# EAGLE design Game of Life v1 (EAGLE 9.6.2)
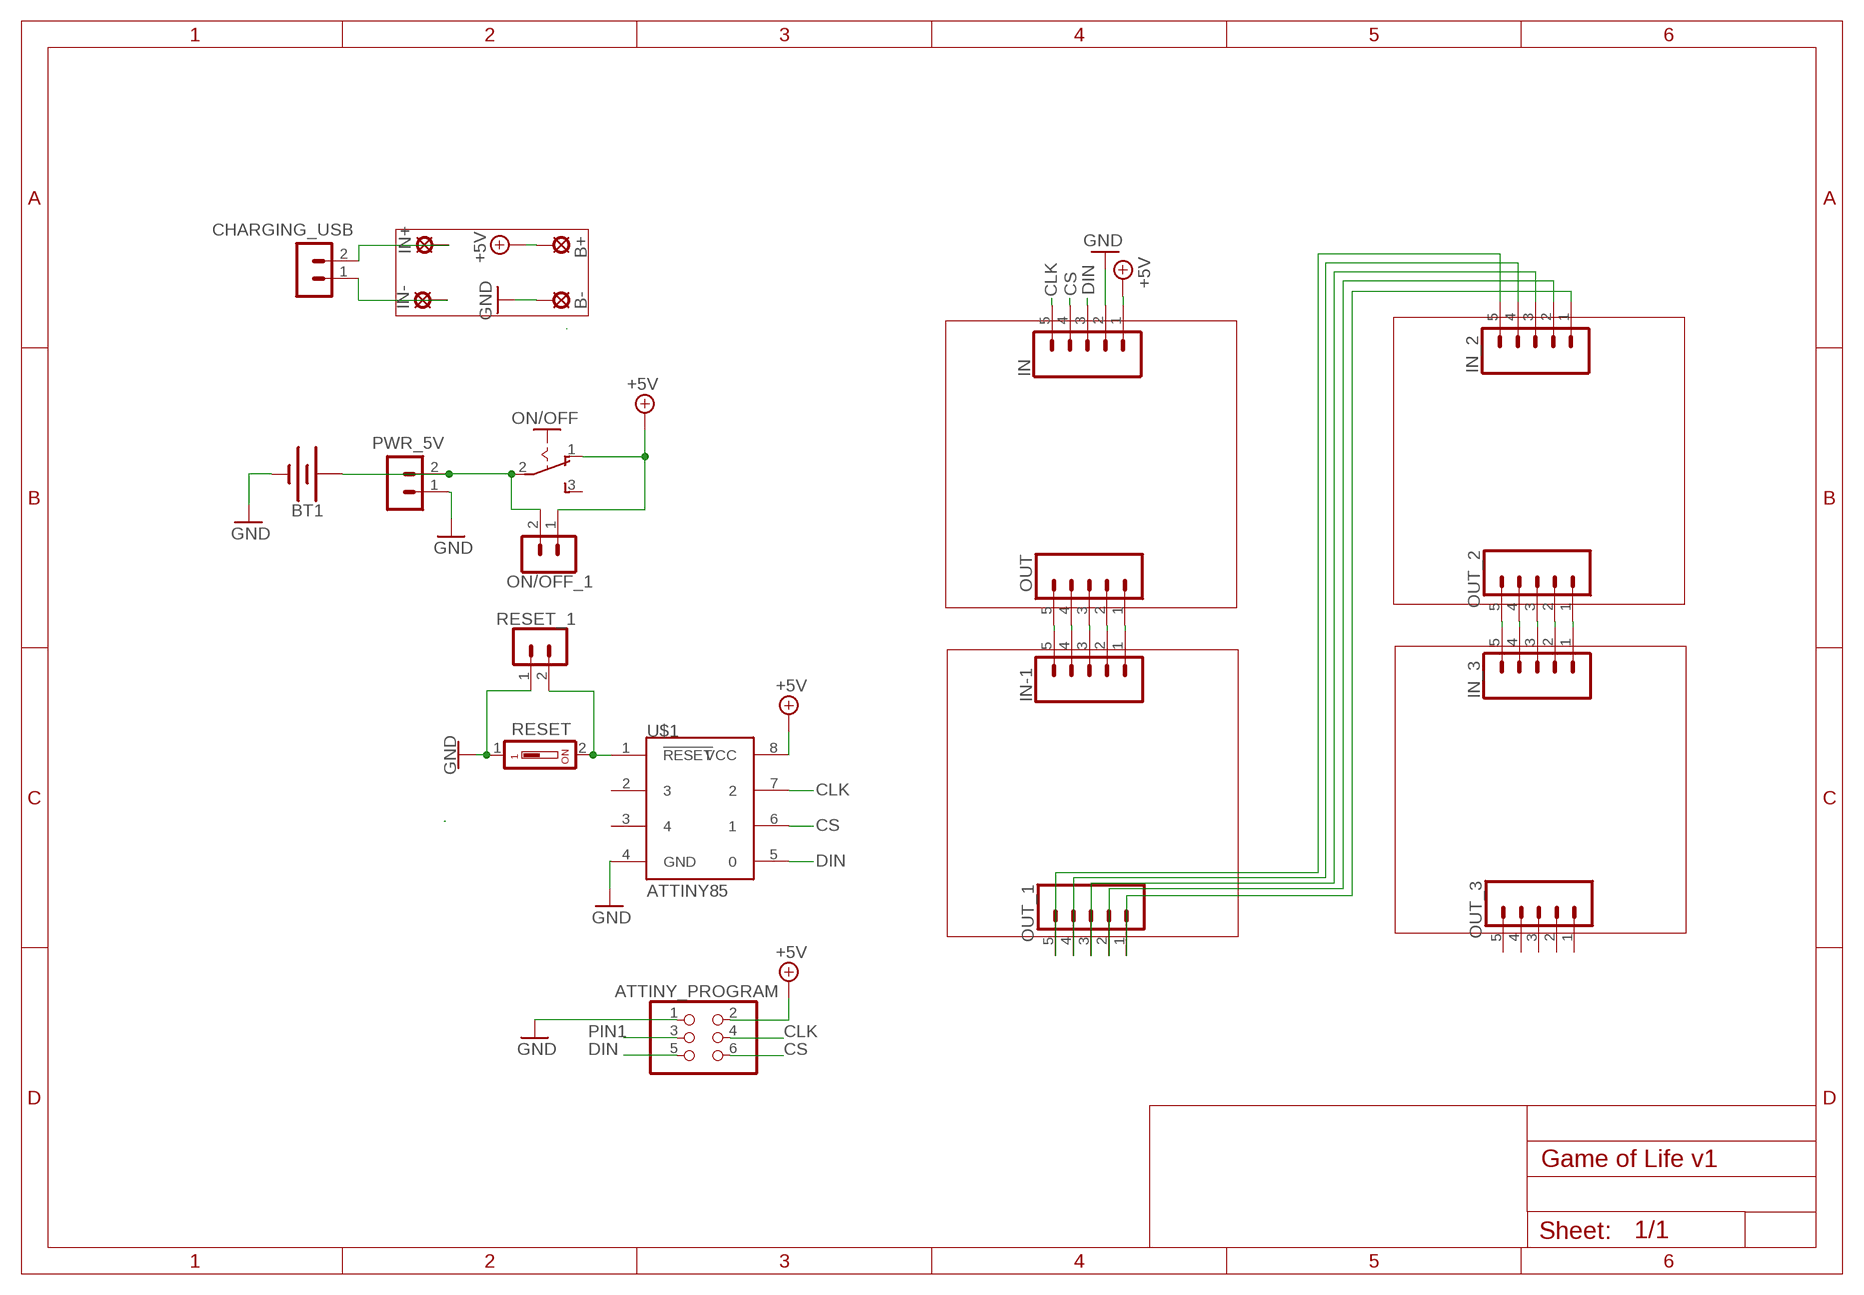
[diagram p0: schematic, sheet 1]

## Parts
ATTINY_PROGRAM  PINHD-2X3  [2X03]
B+  LSP11  [LSP11]
B-  LSP11  [LSP11]
BT1  BATTERY-18650  [BATTERY_18650-HOLDER]
CHARGING_USB  B2B-PH-K-S  [B2B-PH-K-S]
IN  CONN_05  [1X05]
IN+  LSP11  [LSP11]
IN-  LSP11  [LSP11]
IN-1  CONN_05  [1X05]
IN_2  CONN_05  [1X05]
IN_3  CONN_05  [1X05]
ON/OFF  M251  [M251]
ON/OFF_1  B2B-PH-K-S  [B2B-PH-K-S]
OUT  CONN_05  [1X05]
OUT_1  CONN_05  [1X05]
OUT_2  CONN_05  [1X05]
OUT_3  CONN_05  [1X05]
PWR_5V  B2B-PH-K-S  [B2B-PH-K-S]
RESET  DS01  [DS-01]
RESET_1  B2B-PH-K-S  [B2B-PH-K-S]
U$1  ATTINY85  [8P3]

## Nets
+5V: ATTINY_PROGRAM.2 B+.MP IN.1 ON/OFF.1(O) ON/OFF_1.1 U$1.8(VCC)
CLK: ATTINY_PROGRAM.4 IN.5 U$1.7
CS: ATTINY_PROGRAM.6 IN.4 U$1.6
DIN: ATTINY_PROGRAM.5 IN.3 U$1.5
GND: ATTINY_PROGRAM.1 B-.MP BT1.GND@1(-) IN.2 PWR_5V.1 RESET.1 RESET_1.1 U$1.4(GND)
N$2: BT1.PWR@1(+) ON/OFF.2(P) ON/OFF_1.2 PWR_5V.2
N$3: CHARGING_USB.2 IN+.MP
N$4: IN-1.1 OUT.1
N$5: IN-1.2 OUT.2
N$6: IN-1.3 OUT.3
N$7: IN-1.4 OUT.4
N$8: IN-1.5 OUT.5
N$9: IN_3.1 OUT_2.1
N$10: IN_3.2 OUT_2.2
N$11: IN_3.3 OUT_2.3
N$12: IN_3.4 OUT_2.4
N$13: IN_3.5 OUT_2.5
N$14: IN_2.1 OUT_1.1
N$15: IN_2.2 OUT_1.2
N$16: IN_2.3 OUT_1.3
N$18: IN_2.5 OUT_1.5
N$19: IN_2.4 OUT_1.4
N$20: CHARGING_USB.1 IN-.MP
PIN1: ATTINY_PROGRAM.3 RESET.2 RESET_1.2 U$1.1(!RESET)
Unconnected: ON/OFF.3(S) OUT_3.1 OUT_3.2 OUT_3.3 OUT_3.4 OUT_3.5 U$1.2 U$1.3

## Library data of the parts
ATTINY_PROGRAM = pinhead:PINHD-2X3: PIN HEADER
B+ B- IN+ IN- = solpad:LSP11: SOLDER PAD drill 1.1 mm
BT1 = SparkFun-Batteries:BATTERY: Battery - Single Cell A variety of battery chemistries, sizes, and footprints. Device List: 20MM_PTH - Coin Cell Battery Holder - 20mm (PTH) <https://www.sparkfun.com/products/783> 20MM_PTH_KIT- Coin Cell battery Holder - 20 mm (PTH) <http://www.sparkfun.com/products/783>kit version with special mask 6.8MM_PTH - Coin Cell Battery Holder - 6.8MM(SMD) <https://www.digikey.com/product-detail/en/seiko-instruments/MS621FE-FL11E/728-1057-ND/1889208?WT.srch=1&gclid=CNOQ5a6LzdQCFZS2wAodXCkE0g> 12MM_SMD - Coin Cell Battery Holder - 12mm (SMD) <https://www.sparkfun.com/products/10592> 12MM_PTH - Coin Cell Battery Holder - 12mm (PTH) <https://www.sparkfun.com/products/7948> 20MM_SMD - 20mm Coin Cell Battery Holder (SMD) (2 legs) Used on the Big Time Watch Kit <https://www.sparkfun.com/products/11734> 20MM_SMD_4LEGS - Coin Cell Battery Holder - 20mm (SMD) <https://www.sparkfun.com/products/11892> 20MM_SMD_4LEGS_OVERPASTE - Coin Cell Battery Holder - 20mm (SMD) <https://www.sparkfun.com/products/11892> (Over-paste on the legs) 24.5MM_PTH - Coin Cell Battery Holder - 24.5mm (PTH) <https://www.sparkfun.com/products/8863> 9V - 9V Battery Holder - PC Mount Used on the SparkFun SparkPunk Sound Kit <https://www.sparkfun.com/products/11177> and SparkFun SparkPunk Sequencer Kit <https://www.sparkfun.com/products/12707> 18650 - Battery Holder - 18650 (PTH) <https://www.sparkfun.com/products/13113> AA - Battery Holder - 1xAA (PTH) <https://www.sparkfun.com/products/7949> AAA - Battery Holder - 1xAAA (PTH) <https://www.sparkfun.com/products/12718> AA_KIT - Battery Holder - 1xAA (PTH) <https://www.sparkfun.com/products/7949> Special kit package - pads only have exposed copper on one side of the board. AAA_KIT - Battery Holder - 1xAAA (PTH) <https://www.sparkfun.com/products/12718> Special kit package - pads only have exposed copper on one side of the board.; PROD_ID: BATT-12327; SF_SKU: PRT-13113
CHARGING_USB ON/OFF_1 PWR_5V RESET_1 = con-JST PH:B2B-PH: JST PH series header 2.00mm pitch disconnectable crimp style connectors, vertical (side entry type), 2 pins
IN IN-1 IN_2 IN_3 OUT OUT_1-OUT_3 = SparkFun-Connectors:CONN_05: Multi connection point. Often used as Generic Header-pin footprint for 0.1 inch spaced/style header connections On any of the 0.1 inch spaced packages, you can populate with these: Break Away Headers - Straight <https://www.sparkfun.com/products/116> (PRT-00116) Break Away Male Headers - Right Angle <https://www.sparkfun.com/products/553> (PRT-00553) Female Headers <https://www.sparkfun.com/products/115> (PRT-00115) Break Away Headers - Machine Pin <https://www.sparkfun.com/products/117> (PRT-00117) Break Away Female Headers - Swiss Machine Pin <https://www.sparkfun.com/products/743> (PRT-00743) For SCREWTERMINALS and SPRING TERMINALS visit here: Screw Terimnals on SparkFun.com <https://www.sparkfun.com/search/results?term=Screw+Terminals> (5mm/3.5mm/2.54mm spacing) This device is also useful as a general connection point to wire up your design to another part of your project. Our various solder wires solder well into these plated through hole pads. Hook-Up Wire - Assortment (Stranded, 22 AWG) <https://www.sparkfun.com/products/11375> (PRT-11375) Hook-Up Wire - Assortment (Solid Core, 22 AWG) <https://www.sparkfun.com/products/11367> (PRT-11367) View the entire wire category on our website here <https://www.sparkfun.com/categories/141> Special notes: Molex polarized connector foot print use with SKU : PRT-08231 with associated crimp pins and housings. 1MM SMD Version SKU: PRT-10208
ON/OFF = switches M Dunn:M251: SLIDING SWITCH Mors, distributor Buerklin, 11G702
RESET = 5mm SPST Switch:DS01: DIL/CODE SWITCH; OC_FARNELL: unknown; OC_NEWARK: unknown
U$1 = attiny85:ATTINY85

## Board
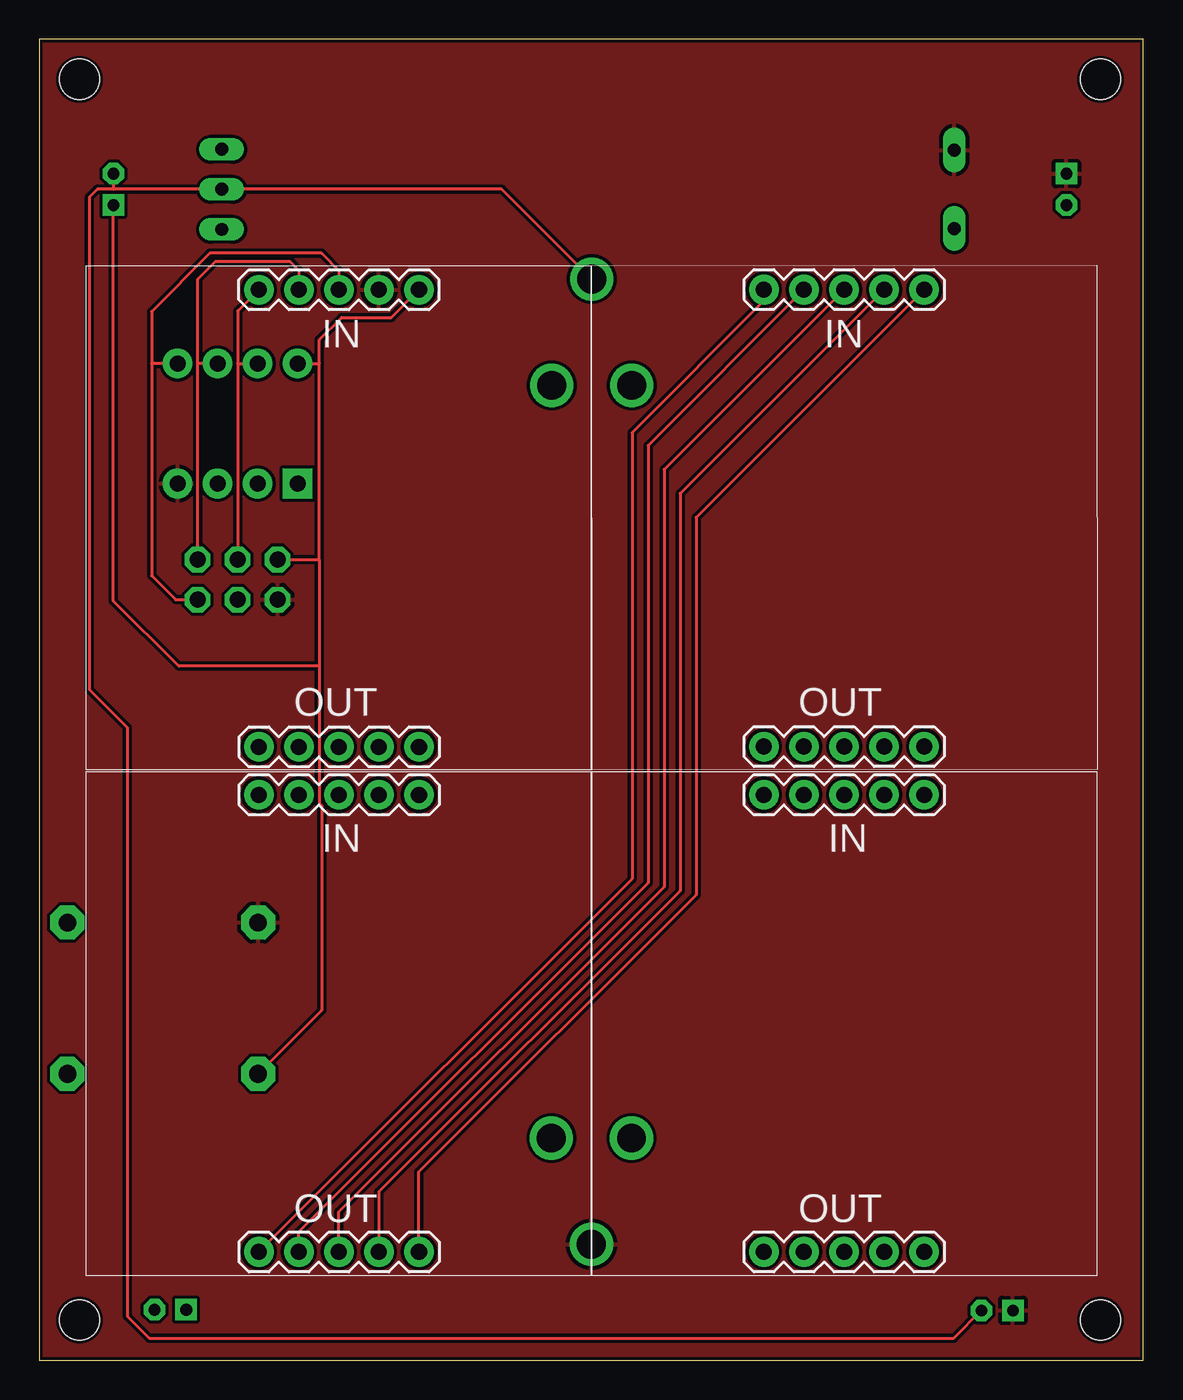
[diagram p1: board, top side]
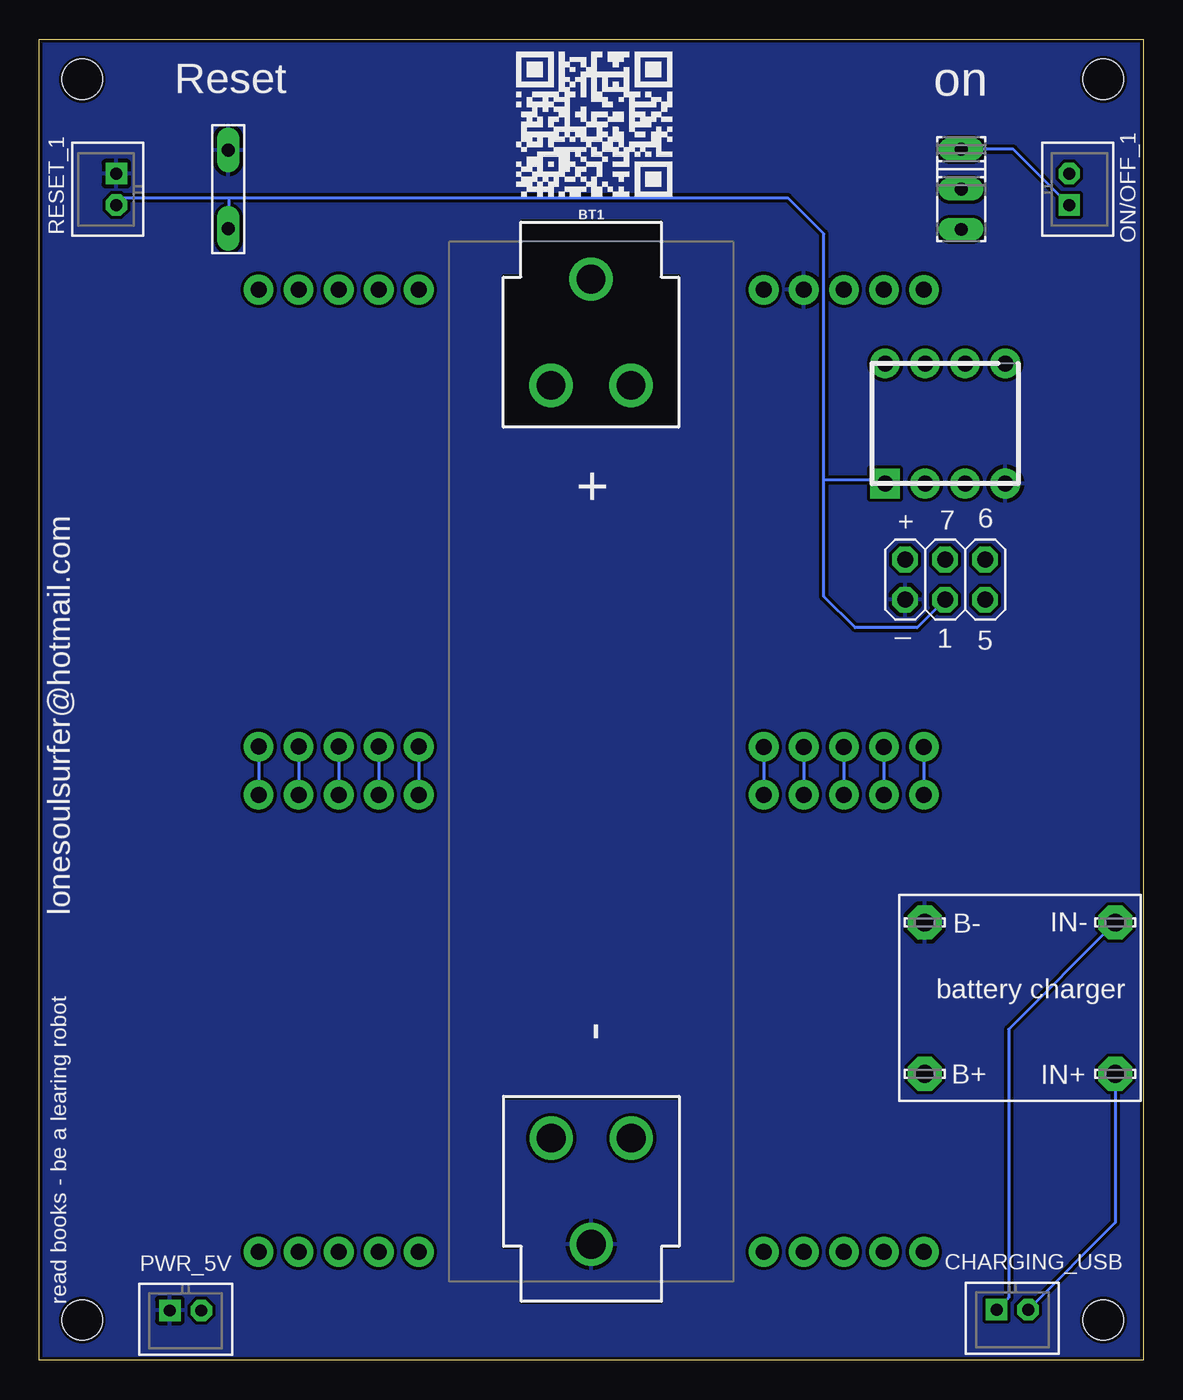
[diagram p2: board, bottom side, seen from below]

Size 70.03 x 83.81 mm. Coordinates in mm from the lower left corner, seen from the top.
Outline: 0,0 70.03,0 70.03,83.81 0,83.81 0,0
Copper layers (1*16): Top 0.035mm / dielectric 1.5mm / Bottom 0.035mm
Design rules "SparkFun": minimum track width 8mil, minimum drill 20mil, track to track 8mil, track to pad 8mil, pad to pad 8mil, via to via 8mil, smd to smd 8mil, copper to edge 8mil, drill to drill 8mil, minimum pad ring 12mil, minimum via ring 10mil, stop-mask expansion 4mil, vias tented up to drill 20mil, thermal gap 10mil
Holes 2.54 mm at 2.54,2.54 67.31,2.54 67.31,81.28 2.54,81.28

### Footprints (pad centres in the part's own frame; a part is rotated, then mirrored left to right if it is on the bottom)
2X03 = drill 1.016 octagon: 1 -2.54,-1.27; 2 -2.54,1.27; 3 0,-1.27; 4 0,1.27; 5 2.54,-1.27; 6 2.54,1.27
LSP11 = drill 1.118 pad 2.159 octagon: MP 0,0
BATTERY_18650-HOLDER = drill 1.829: GND@1 30.628,0.01; GND@2 23.88,2.55; GND@3 23.88,-2.53; PWR@1 -30.628,-0.01; PWR@2 -23.88,2.53; PWR@3 -23.88,-2.55
B2B-PH-K-S = drill 0.75 pad 1.3 square: 1 1,0 | drill 0.75 pad 1.3 octagon: 2 -1,0
1X05 = drill 1.016 pad 1.88: 1 0,0; 2 2.54,0; 3 5.08,0; 4 7.62,0; 5 10.16,0
M251 = drill 0.813 long: 1 -2.54,0; 2 0,0; 3 2.54,0
DS-01 = drill 0.813 long: 1 2.489,0; 2 -2.489,0
8P3 = drill 1.016 pad 1.88 square: 1 -3.81,3.81 | drill 1.016 pad 1.88: 2 -3.81,1.27; 3 -3.81,-1.27; 4 -3.81,-3.81; 5 3.81,-3.81; 6 3.81,-1.27; 7 3.81,1.27; 8 3.81,3.81

### Placement (x,y rotation side)
ATTINY_PROGRAM  12.57,49.53 0 bottom
B+  13.87,18.16 180 bottom
B-  13.87,27.76 180 bottom
BT1  35.03,37.97 270 bottom
CHARGING_USB  8.31,3.2 180 bottom
IN  24.08,67.92 180 top
IN+  1.78,18.16 180 bottom
IN-  1.78,27.76 0 bottom
IN-1  13.92,35.88 0 top
IN_2  45.96,67.93 0 top
IN_3  45.96,35.88 0 top
ON/OFF  11.56,74.29 270 bottom
ON/OFF_1  4.7,74.29 270 bottom
OUT  13.92,38.91 0 top
OUT_1  13.92,6.87 0 top
OUT_2  45.96,38.93 0 top
OUT_3  45.96,6.87 0 top
PWR_5V  60.76,3.15 180 bottom
RESET  58.04,74.29 90 bottom
RESET_1  65.15,74.29 90 bottom
U$1  12.57,59.44 90 bottom

### Tracks (layer width: path | path; a pad name or v marks a point on that pad's centre or on a via)
+5V
  Top 0.203: ATTINY_PROGRAM.2 17.75,50.8 | 17.75,50.8 17.75,44.04 | 17.75,44.04 17.75,35.36 17.91,35.21 17.91,22.2 B+.MP | 17.75,50.8 17.75,63.25 | 17.75,63.25 17.75,64.75 19.18,66.17 22.33,66.17 IN.1 | U$1.8 17.75,63.25 | 17.75,44.04 8.84,44.04 4.7,48.18 ON/OFF_1.1
  Bottom 0.203: ON/OFF_1.1 8.24,76.84 ON/OFF.1
CLK
  Top 0.203: IN.5 12.57,66.57 12.57,63.25 | 12.57,63.25 U$1.7 | 12.57,63.25 ATTINY_PROGRAM.4
CS
  Top 0.203: ATTINY_PROGRAM.6 10.03,63.25 | 10.03,63.25 10.03,68.58 11.18,69.72 15.88,69.72 16.46,69.14 IN.4 | U$1.6 10.03,63.25
DIN
  Top 0.203: IN.3 19,69.14 17.91,70.23 10.79,70.23 7.11,66.55 7.11,63.25 | 7.11,63.25 7.11,49.78 8.64,48.26 ATTINY_PROGRAM.5 | U$1.5 7.11,63.25
GND
  pour Top: 0,83.82 70.1,83.82 70.1,0 0,0
  pour Bottom: 0,83.82 70.1,83.82 70.1,0 0,0
N$2
  Top 0.203: PWR_5V.2 58,1.4 6.97,1.4 5.59,2.78 5.59,40.13 3.18,42.55 3.18,73.79 3.68,74.29 4.7,74.29 | 4.7,74.29 ON/OFF.2 29.34,74.29 BT1.PWR@1 | ON/OFF_1.2 4.7,74.29
N$3
  Bottom 0.203: IN+.MP 1.78,8.73 CHARGING_USB.2
N$4
  Bottom 0.203: OUT.1 IN-1.1
N$5
  Bottom 0.203: OUT.2 IN-1.2
N$6
  Bottom 0.203: OUT.3 IN-1.3
N$7
  Bottom 0.203: OUT.4 IN-1.4
N$8
  Bottom 0.203: OUT.5 IN-1.5
N$9
  Bottom 0.203: OUT_2.1 IN_3.1
N$10
  Bottom 0.203: OUT_2.2 IN_3.2
N$11
  Bottom 0.203: OUT_2.3 IN_3.3
N$12
  Bottom 0.203: OUT_2.4 IN_3.4
N$13
  Bottom 0.203: OUT_2.5 IN_3.5
N$14
  Top 0.203: OUT_1.1 37.59,30.54 37.59,58.85 45.96,67.22 IN_2.1
N$15
  Top 0.203: OUT_1.2 16.46,8.14 38.61,30.29 38.61,58.04 IN_2.2
N$16
  Top 0.203: OUT_1.3 19,9.41 39.62,30.03 39.62,56.51 IN_2.3
N$18
  Top 0.203: OUT_1.5 24.08,11.95 41.66,29.53 41.66,53.47 IN_2.5
N$19
  Top 0.203: OUT_1.4 21.54,10.68 40.64,29.78 40.64,54.99 IN_2.4
N$20
  Bottom 0.203: IN-.MP 8.54,21 8.54,3.96 CHARGING_USB.1
PIN1
  Bottom 0.203: ATTINY_PROGRAM.3 14.35,46.48 18.29,46.48 20.27,48.46 20.27,55.83 | 20.27,55.83 20.27,71.48 22.55,73.76 58.01,73.76 | 58.01,73.76 58.01,71.83 RESET.2 | U$1.1 16.59,55.83 20.27,55.83 | RESET_1.2 64.68,73.76 58.01,73.76

### Text on the board
tPlace: IN | IN | OUT | OUT | IN | IN | OUT | OUT
bPlace: on | Reset | 6 | 7 | + | lonesoulsurfer@hotmail.com | 1 | _ | 5 | battery charger | read books - be a learing robot